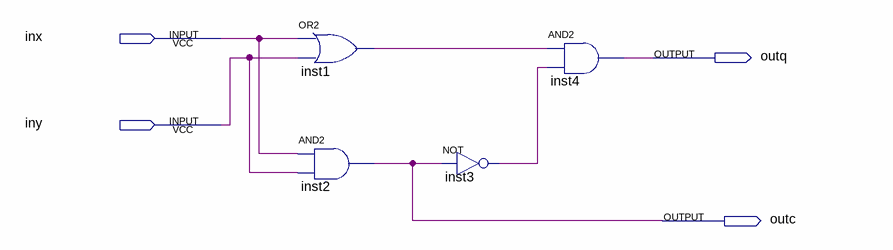
[diagram p0: schematic sheet]
// Quartus schematic SM1_Davydchuk.bdf as structural Verilog: 4 symbols, 4 pins
module SM1_Davydchuk (
  input  inx,
  input  iny,
  output outq,
  output outc
);

  wire inst1_out, inst3_out;

  or inst1 (inst1_out, inx, iny);
  and inst2 (outc, inx, iny);
  not inst3 (inst3_out, outc);
  and inst4 (outq, inst1_out, inst3_out);
endmodule
